# Altium project PMW3389_Card.PrjPcb
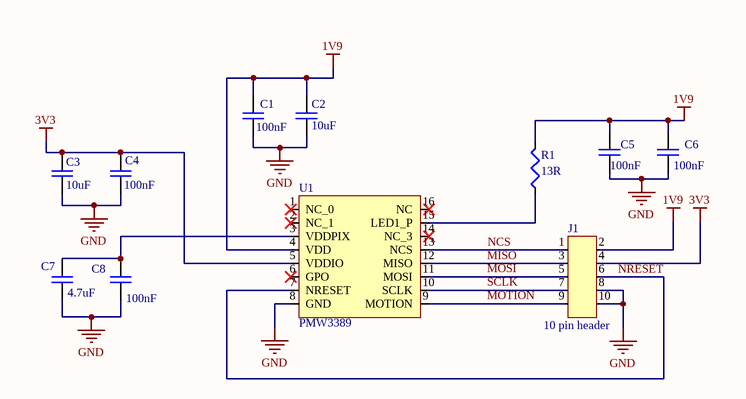
[diagram p0: main_Rev1.SchDoc]
1 sheet, 11 parts. Net scope: global (net labels, ports and power ports of the same name join across sheets).
Board file: PMW3389_Rev1.PcbDoc

## Sheet main_Rev1.SchDoc
size A4

### Parts
C1  value 100nF  [C0603]  (hidden comment: 02016D104KAT2A)
C2  value 10uF  [C0805]  (hidden comment: 08053C105KAT2A)
C3  value 10uF  [C0805]  (hidden comment: 08053C105KAT2A)
C4  value 100nF  [C0603]  (hidden comment: 02016D104KAT2A)
C5  value 100nF  [C0603]  (hidden comment: 02016D104KAT2A)
C6  value 100nF  [C0603]  (hidden comment: 02016D104KAT2A)
C7  value 4.7uF  [C0805]  (hidden comment: 08053C105KAT2A)
C8  value 100nF  [C0603]  (hidden comment: 02016D104KAT2A)
J1  10 pin header  [10 pin header]
R1  value 13R  [R0603]  (hidden comment: CPF-A-0603B100KE1)
U1  PMW3389  [PMW3389]

### Nets
1V9: C1.2 C2.2 C5.2 C6.2 J1.2 R1.2 U1.4(VDD)
3V3: C3.2 C4.2 J1.4 U1.5(VDDIO)
GND: C1.1 C2.1 C3.1 C4.1 C5.1 C6.1 C7.1 C8.1 J1.8 J1.10 U1.8(GND)
MISO: J1.3 U1.12(MISO)
MOSI: J1.5 U1.11(MOSI)
MOTION: J1.9 U1.9(MOTION)
NCS: J1.1 U1.13(NCS)
NRESET: J1.6 U1.7(NRESET)
SCLK: J1.7 U1.10(SCLK)
NetC7_2: C7.2 C8.2 U1.3(VDDPIX)
NetR1_1: R1.1 U1.15(LED1_P)

Not connected (* = marked no-connect by the designer): U1 1(NC_0)* 2(NC_1)* 6(GPO)* 14(NC_3)* 16(NC)*

### Library data of the parts
C1 C4 C8 = 02016D104KAT2A: C0603
C2 C3 C7 = 08053C105KAT2A: C0805
C5 C6 = 02016D104KAT2A: Decoupling LED_P.
R1 = CPF-A-0603B100KE1: Current limiter LED_P